# Altium schematic sheet LED_Shield_PCB_v11.SchDoc
size A4; SheetNumber: 1; SheetTotal: 1
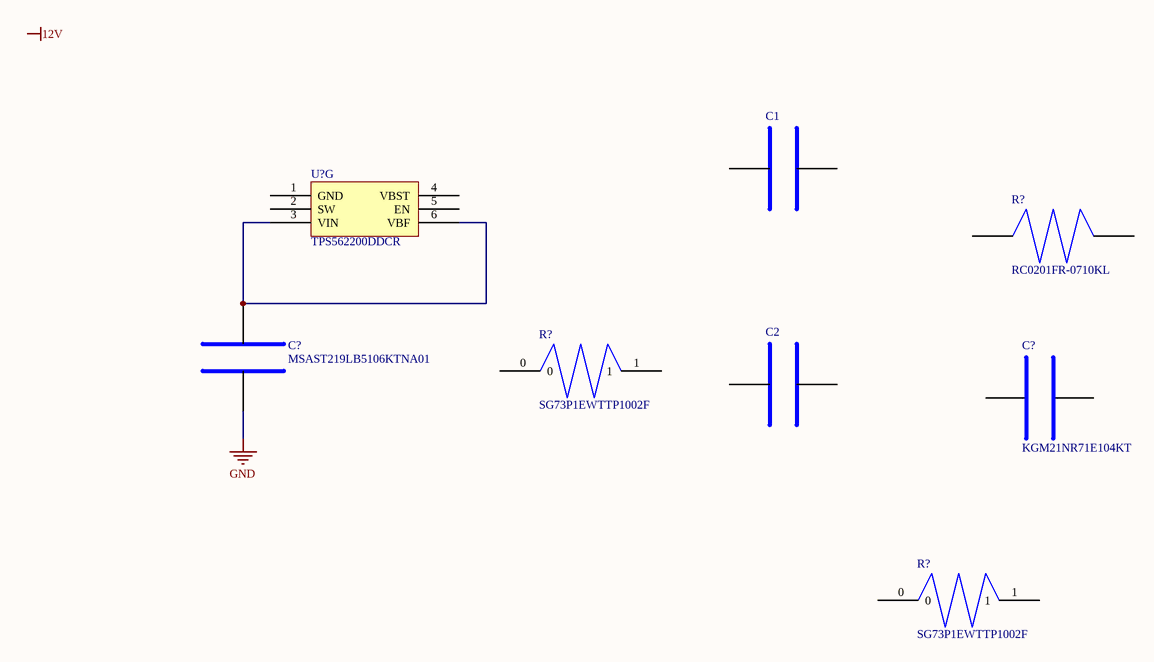
[diagram p0: LED_Shield_PCB_v11.SchDoc]

## Parts
(Parts that share a designator on the sheet are numbered #1, #2 ... from top to bottom, then left to right.)
C1  MSAST219LB5106KTNA01  [C_0805 (2012 Metric)]  (value not drawn)
C2  MSAST219LB5106KTNA01  [C_0805 (2012 Metric)]  (value not drawn)
C?#1  MSAST219LB5106KTNA01  [C_0805 (2012 Metric)]
C?#2  KGM21NR71E104KT  [C_0805 (2012 Metric)_2]
R?#1  RC0201FR-0710KL
R?#2  SG73P1EWTTP1002F  [R_0402 (1005 Metric)]
R?#3  SG73P1EWTTP1002F  [R_0402 (1005 Metric)]
U?  TPS562200DDCR  [U_SOT-23-6 Thin, TSOT-23-6]  (part G of 7)

## Nets
GND: C?#1.0
NetC?#1_1: C?#1.1 U?.3(VIN) U?.6(VBF)

Not connected (* = marked no-connect by the designer): C1 0 1; C2 0 1; C?#2 0 1; R?#1 0 1; R?#2 0 1; R?#3 0 1; U? 1(GND) 2(SW) 4(VBST) 5(EN)

## Notes on the sheet
- Labels drawn without touching a wire or pin: 12V

## Library data of the parts
C1 C2 C?#1 = MSAST219LB5106KTNA01: Ceramic Capacitor, Multilayer, Ceramic, 25V, 10% +Tol, 10% -Tol, X5R, 15% TC, 10uF, Surface Mount, 0805; Manufacturer: TAIYO YUDEN; Value: 10µF; Supplier: Arrow Electronics; Supplier Part Number: MSAST219LB5106KTNA01; Manufacturer Part Number: MSAST219LB5106KTNA01; RoHS: Compliant; Category: Ceramic Capacitors; Stock: 7; Pricing: 1=0,0066 (USD); Dielectric Material: Ceramic; Export Control Classification Number (ECCN) Code: EAR99; Height: 850µm; Harmonized Tariff Schedule (HTS) Code: 8532.24.00.20; Introduction Date: 2022-02-17; Length: 2mm; Lifecycle Status: Production; Max Operating Temperature: 85°C; Min Operating Temperature: -55°C; Mounting Technology: Surface Mount; Number of Terminals: 2; REACH SVHC: Yes; Voltage Rating (DC): 25V; Width: 1.25mm; ComponentLink1URL: https://datasheet.octopart.com:443/MSAST219LB5106KTNA01-Taiyo-Yuden-datasheet-182126366.pdf?src-supplier=IHS; ComponentLink1Description: https://datasheet.octopart.com:443/MSAST219LB5106KTNA01-Taiyo-Yuden-datasheet-182126366.pdf?src-supplier=IHS
R?#1 = RC0201FR-0710KL: Res Thick Film 0201 10K Ohm 1% 0.05W(1/20W) ±200ppm/C Pad SMD T/R; Manufacturer: Yageo Group; Max Power Dissipation: 50mW; Value: 10kΩ; Temperature Coefficient: 200ppm/°C; Voltage Rating: 25V; Supplier: Farnell; Supplier Part Number: 1857008; Manufacturer Part Number: RC0201FR-0710KL; RoHS: Compliant; Category: Chip SMD Resistors; Stock: 170907; Pricing: 10=0,0092, 100=0,0072, 500=0,0059, 2500=0,0046, 5000=0,0045 (EUR); Case/Package: 0201; Case Code (Imperial): 0201; Case Code (Metric): 0603; China RoHS: Non-Compliant; Composition: Thick Film; Contact Plating: Tin; Country of Origin: Mainland China, Taiwan; Depth: 300µm; Export Control Classification Number (ECCN) Code: EAR99; Features: Moisture Resistant; Height: 230µm; Harmonized Tariff Schedule (HTS) Code: 8533.21.00.30; Introduction Date: 2008-07-18; Lead Free: Lead Free; Length: 600µm; Lifecycle Status: Production; Max Operating Temperature: 125°C; Military Standard: Not; Min Operating Temperature: -55°C; Mounting Technology: Surface Mount; Pins: 2; Number of Terminals: 2; Number of Terminations: 2; Packaging: Tape & Reel; Power Dissipation: 50mW; Power Rating: 50mW; Radiation Hardening: No; REACH SVHC: Yes; Schedule B: 8533210045, 8533210045|8533210045|8533210045|8533210045|8533210045|8533210045|8533210045|8533210045|8533210045|8533210045|8533210045|8533210045|8533210045|8533210045|8533210045|8533210045|8533210045|8533210045|8533210045, 8533210045|8533210045|8533210045|8533210045|8533210045|8533210045|8533210045|8533210045|8533210045|8533210045|8533210045|8533210045|8533210045|8533210045|8533210045|8533210045|8533210045|8533210045|8533210045|8533210045, 8533210045|8533210045|8533210045|8533210045|8533210045|8533210045|8533210045|8533210045|8533210045|8533210045|8533210045|8533210045|8533210045|8533210045|8533210045|8533210045|8533210045|8533210045|8533210045|8533210045|8533210045; Termination: SMD/SMT; Tolerance: 1%; Voltage Rating (DC): 25V; Weight: 170.097139µg; Width: 300µm; Working Voltage: 25V; ComponentLink1URL: https://datasheet.octopart.com:443/RC0201FR-0710KL-Yageo-datasheet-175887523.pdf?src-supplier=IHS; ComponentLink1Description: https://datasheet.octopart.com:443/RC0201FR-0710KL-Yageo-datasheet-175887523.pdf?src-supplier=IHS; ComponentLink2URL: https://datasheet.octopart.com:443/RC0201FR-0710KL-Yageo-datasheet-12509713.pdf?src-supplier=element14+APAC; ComponentLink2Description: https://datasheet.octopart.com:443/RC0201FR-0710KL-Yageo-datasheet-12509713.pdf?src-supplier=element14+APAC; ComponentLink3URL: https://datasheet.octopart.com:443/RC0201FR-0710KL-Yageo-datasheet-62067350.pdf?src-supplier=element14+APAC; ComponentLink3Description: https://datasheet.octopart.com:443/RC0201FR-0710KL-Yageo-datasheet-62067350.pdf?src-supplier=element14+APAC; ComponentLink4URL: https://datasheet.octopart.com:443/RC0201FR-0710KL-Yageo-datasheet-10911895.pdf?src-supplier=element14+APAC; ComponentLink4Description: https://datasheet.octopart.com:443/RC0201FR-0710KL-Yageo-datasheet-10911895.pdf?src-supplier=element14+APAC; ComponentLink5URL: https://datasheet.octopart.com:443/RC0201FR-0710KL-Yageo-datasheet-13314888.pdf?src-supplier=Upverter; ComponentLink5Description: https://datasheet.octopart.com:443/RC0201FR-0710KL-Yageo-datasheet-13314888.pdf?src-supplier=Upverter; ComponentLink6URL: https://datasheet.octopart.com:443/RC0201FR-0710KL-Yageo-datasheet-12549147.pdf?src-supplier=Upverter; ComponentLink6Description: https://datasheet.octopart.com:443/RC0201FR-0710KL-Yageo-datasheet-12549147.pdf?src-supplier=Upverter; ComponentLink7URL: https://datasheet.octopart.com:443/RC0201FR-0710KL-Yageo-datasheet-12509741.pdf?src-supplier=Upverter; ComponentLink7Description: https://datasheet.octopart.com:443/RC0201FR-0710KL-Yageo-datasheet-12509741.pdf?src-supplier=Upverter; ComponentLink8URL: https://datasheet.octopart.com:443/RC0201FR-0710KL-Yageo-Group-datasheet-190305687.pdf?src-supplier=Newark; ComponentLink8Description: https://datasheet.octopart.com:443/RC0201FR-0710KL-Yageo-Group-datasheet-190305687.pdf?src-supplier=Newark; ComponentLink9URL: https://datasheet.octopart.com:443/RC0201FR-0710KL-Yageo-datasheet-10025917.pdf?src-supplier=Newark; ComponentLink9Description: https://datasheet.octopart.com:443/RC0201FR-0710KL-Yageo-datasheet-10025917.pdf?src-supplier=Newark; ComponentLink10URL: https://datasheet.octopart.com:443/RC0201FR-0710KL-Yageo-Group-datasheet-176638170.pdf?src-supplier=Future+Electronics; ComponentLink10Description: https://datasheet.octopart.com:443/RC0201FR-0710KL-Yageo-Group-datasheet-176638170.pdf?src-supplier=Future+Electronics; ComponentLink11URL: https://datasheet.octopart.com:443/RC0201FR-0710KL-Yageo-datasheet-164759695.pdf?src-supplier=Future+Electronics; ComponentLink11Description: https://datasheet.octopart.com:443/RC0201FR-0710KL-Yageo-datasheet-164759695.pdf?src-supplier=Future+Electronics; ComponentLink12URL: https://datasheet.octopart.com:443/RC0201FR-0710KL-Yageo-datasheet-127823281.pdf?src-supplier=Future+Electronics; ComponentLink12Description: https://datasheet.octopart.com:443/RC0201FR-0710KL-Yageo-datasheet-127823281.pdf?src-supplier=Future+Electronics; ComponentLink13URL: https://datasheet.octopart.com:443/RC0201FR-0710KL-Yageo-datasheet-137700087.pdf?src-supplier=Future+Electronics; ComponentLink13Description: https://datasheet.octopart.com:443/RC0201FR-0710KL-Yageo-datasheet-137700087.pdf?src-supplier=Future+Electronics; ComponentLink14URL: https://datasheet.octopart.com:443/RC0201FR-0710KL-Yageo-datasheet-103092701.pdf?src-supplier=Future+Electronics; ComponentLink14Description: https://datasheet.octopart.com:443/RC0201FR-0710KL-Yageo-datasheet-103092701.pdf?src-supplier=Future+Electronics; ComponentLink15URL: https://datasheet.octopart.com:443/RC0201FR-0710KL-Yageo-datasheet-98239111.pdf?src-supplier=Future+Electronics; ComponentLink15Description: https://datasheet.octopart.com:443/RC0201FR-0710KL-Yageo-datasheet-98239111.pdf?src-supplier=Future+Electronics; ComponentLink16URL: https://datasheet.octopart.com:443/RC0201FR-0710KL-Yageo-datasheet-44382975.pdf?src-supplier=Future+Electronics; ComponentLink16Description: https://datasheet.octopart.com:443/RC0201FR-0710KL-Yageo-datasheet-44382975.pdf?src-supplier=Future+Electronics; ComponentLink17URL: https://datasheet.octopart.com:443/RC0201FR-0710KL-Yageo-datasheet-41589693.pdf?src-supplier=Future+Electronics; ComponentLink17Description: https://datasheet.octopart.com:443/RC0201FR-0710KL-Yageo-datasheet-41589693.pdf?src-supplier=Future+Electronics; ComponentLink18URL: https://datasheet.octopart.com:443/RC0201FR-0710KL-Yageo-datasheet-37140709.pdf?src-supplier=Future+Electronics; ComponentLink18Description: https://datasheet.octopart.com:443/RC0201FR-0710KL-Yageo-datasheet-37140709.pdf?src-supplier=Future+Electronics; ComponentLink19URL: https://datasheet.octopart.com:443/RC0201FR-0710KL-Yageo-datasheet-12509768.pdf?src-supplier=Future+Electronics; ComponentLink19Description: https://datasheet.octopart.com:443/RC0201FR-0710KL-Yageo-datasheet-12509768.pdf?src-supplier=Future+Electronics; ComponentLink20URL: https://datasheet.octopart.com:443/RC0201FR-0710KL-Yageo-datasheet-12590898.pdf?src-supplier=Future+Electronics; ComponentLink20Description: https://datasheet.octopart.com:443/RC0201FR-0710KL-Yageo-datasheet-12590898.pdf?src-supplier=Future+Electronics; ComponentLink21URL: https://datasheet.octopart.com:443/RC0201FR-0710KL-Yageo-datasheet-5319114.pdf?src-supplier=Future+Electronics; ComponentLink21Description: https://datasheet.octopart.com:443/RC0201FR-0710KL-Yageo-datasheet-5319114.pdf?src-supplier=Future+Electronics; ComponentLink22URL: https://datasheet.octopart.com:443/RC0201FR-0710KL-Yageo-datasheet-12535854.pdf?src-supplier=Future+Electronics; ComponentLink22Description: https://datasheet.octopart.com:443/RC0201FR-0710KL-Yageo-datasheet-12535854.pdf?src-supplier=Future+Electronics; ComponentLink23URL: https://datasheet.octopart.com:443/RC0201FR-0710KL-Yageo-datasheet-148775077.pdf?src-supplier=TME; ComponentLink23Description: https://datasheet.octopart.com:443/RC0201FR-0710KL-Yageo-datasheet-148775077.pdf?src-supplier=TME; ComponentLink24URL: https://datasheet.octopart.com/RC0201FR-0710KL-Yageo-datasheet-73766026.pdf; ComponentLink24Description: https://datasheet.octopart.com/RC0201FR-0710KL-Yageo-datasheet-73766026.pdf; ComponentLink25URL: https://datasheet.octopart.com:443/RC0201FR-0710KL-Yageo-datasheet-8701561.pdf?src-supplier=element14; ComponentLink25Description: https://datasheet.octopart.com:443/RC0201FR-0710KL-Yageo-datasheet-8701561.pdf?src-supplier=element14; ComponentLink26URL: http://sigma.octopart.com:80/conflict_mineral_statement/Yageo-company-3.pdf?src-supplier=Compliance+Statements; ComponentLink26Description: http://sigma.octopart.com:80/conflict_mineral_statement/Yageo-company-3.pdf?src-supplier=Compliance+Statements; ComponentLink27URL: http://sigma.octopart.com:80/rohs_statement/Yageo-company-2.pdf?src-supplier=Compliance+Statements; ComponentLink27Description: http://sigma.octopart.com:80/rohs_statement/Yageo-company-2.pdf?src-supplier=Compliance+Statements
R?#2 R?#3 = SG73P1EWTTP1002F_1: Fixed Resistor, Metal Glaze/Thick Film, 0.25W, 10000ohm, 75V, 1% +/-Tol, Surface Mount, 0402; Manufacturer: KOA Speer; Power Dissipation: 250mW; Value: 10kΩ; Temperature Coefficient: 100ppm/°C; Supplier: Farnell; Supplier Part Number: 3931632; Manufacturer Part Number: SG73P1EWTTP1002F; RoHS: Compliant; Category: Chip SMD Resistors; Stock: 20460; Pricing: 10=0,0488, 100=0,0306, 500=0,0287, 2500=0,0268, 5000=0,022, 10000=0,0191 (EUR); Height: 350µm; Length: 1mm; Lifecycle Status: Production; Max Operating Temperature: 155°C; Min Operating Temperature: -55°C; Mounting Technology: Surface Mount; Number of Terminals: 2; REACH SVHC: Yes; Tolerance: 1%; Width: 500µm; Working Voltage: 75V; ComponentLink1URL: https://datasheet.octopart.com:443/SG73P1EWTTP1002F-KOA-Speer-datasheet-182143735.pdf?src-supplier=IHS; ComponentLink1Description: https://datasheet.octopart.com:443/SG73P1EWTTP1002F-KOA-Speer-datasheet-182143735.pdf?src-supplier=IHS; ComponentLink2URL: http://sigma.octopart.com:80/rohs_statement/KOA-Speer-company-17.pdf?src-supplier=Compliance+Statements; ComponentLink2Description: http://sigma.octopart.com:80/rohs_statement/KOA-Speer-company-17.pdf?src-supplier=Compliance+Statements
U? = TPS562200DDCR_1: Conv DC-DC 4.5V to 17V Step Down Single-Out 0.67V to 7V 2A 6-Pin TSOT-23 T/R; Manufacturer: Texas Instruments; Manufacturer Lifecycle Status: ACTIVE; Max Duty Cycle: 65%; Max Junction Temperature (Tj): 150°C; Min Output Voltage: 765mV; Nominal Supply Current: 230µA; Number of Channels: 1; Output Configuration: Positive; Output Type: Adjustable; Output Voltage: 1.05V; Switching Frequency: 650kHz; Synchronous Rectifier: Yes; Topology: Buck; Supplier: Arrow Electronics; Supplier Part Number: TPS562200DDCR; Manufacturer Part Number: TPS562200DDCR; RoHS: Compliant; Category: Voltage Regulators - Switching; Stock: 33000; Pricing: 3000=0,3243, 6000=0,3137, 9000=0,3113 (USD); Ambient Temperature Range High: 85°C; Case/Package: SOT-23-6; Contact Plating: Tin; Height: 1.1mm; Lead Free: Lead Free; Length: 2.9mm; Lifecycle Status: Production; Max Supply Voltage: 17V; Max Operating Temperature: 125°C; Max Output current: 2A; Max Output Voltage: 7V; Min Input Voltage: 4.5V; Min Operating Temperature: -40°C; Min Supply Voltage: 4.5V; Mounting Technology: Surface Mount; Number of Outputs: 1; Pins: 6; Operating Supply Voltage: 17V; Output Current: 2A; Quiescent Current: 230µA; Radiation Hardening: No; REACH SVHC: No; Schedule B: 8542390000; Thickness: 870µm; Weight: 36.003894mg; Width: 1.6mm; ComponentLink1URL: https://sigma.octopart.com:443/180581133/technical_drawing/Texas-Instruments-TPS562200DDCR.pdf?src-supplier=Texas+Instruments; ComponentLink1Description: https://sigma.octopart.com:443/180581133/technical_drawing/Texas-Instruments-TPS562200DDCR.pdf?src-supplier=Texas+Instruments; ComponentLink2URL: https://octopart.com:443/opatz8j6/c1?t=2utKubAfpiZARX5nFmsE5hGk-Y-tapj6pD_xDeMavGILmoCS9J2eAjjTjNW5Z9c81h6alCPz7bJak1jHKeuWNAeaEIwGhAOxkrndFGX56Qt-YTBzMSW5WpBFdiamkSgyJwOWbAqhxLCfwYLVTxlMZ3D8olLGDhK9RqQ3qjVP-W0npcJpvlqS_C2JNbfqAdkRII-uSWYYqmMgwYeGA5yIbbvEjU5phFCuYsjJv_b7aQSoOIgzwGiDRTTWzzO_HqVSYJIJZJ4c3RZs3GIMQ7XGM0Tmug74GIe09f5U_717lcCnX6GkmB4tYX5l7RHdDg8UKRkvjrB66qfKxFpTpb8aDJ9_oKYvujJkg67F35zetmHwPDR4DgWTV3Fi_ByFnpJz6qQT-ugHig&src-supplier=Texas+Instruments; ComponentLink2Description: https://octopart.com:443/opatz8j6/c1?t=2utKubAfpiZARX5nFmsE5hGk-Y-tapj6pD_xDeMavGILmoCS9J2eAjjTjNW5Z9c81h6alCPz7bJak1jHKeuWNAeaEIwGhAOxkrndFGX56Qt-YTBzMSW5WpBFdiamkSgyJwOWbAqhxLCfwYLVTxlMZ3D8olLGDhK9RqQ3qjVP-W0npcJpvlqS_C2JNbfqAdkRII-uSWYYqmMgwYeGA5yIbbvEjU5phFCuYsjJv_b7aQSoOIgzwGiDRTTWzzO_HqVSYJIJZJ4c3RZs3GIMQ7XGM0Tmug74GIe09f5U_717lcCnX6GkmB4tYX5l7RHdDg8UKRkvjrB66qfKxFpTpb8aDJ9_oKYvujJkg67F35zetmHwPDR4DgWTV3Fi_ByFnpJz6qQT-ugHig&src-supplier=Texas+Instruments; ComponentLink3URL: https://sigma.octopart.com:443/179311906/technical_drawing/Texas-Instruments-TPS562200DDCR.pdf?src-supplier=Texas+Instruments; ComponentLink3Description: https://sigma.octopart.com:443/179311906/technical_drawing/Texas-Instruments-TPS562200DDCR.pdf?src-supplier=Texas+Instruments; ComponentLink4URL: https://sigma.octopart.com:443/159779760/technical_drawing/Texas-Instruments-TPS562200DDCR.pdf?src-supplier=Texas+Instruments; ComponentLink4Description: https://sigma.octopart.com:443/159779760/technical_drawing/Texas-Instruments-TPS562200DDCR.pdf?src-supplier=Texas+Instruments; ComponentLink5URL: https://sigma.octopart.com:443/149167535/technical_drawing/Texas-Instruments-TPS562200DDCR.pdf?src-supplier=Texas+Instruments; ComponentLink5Description: https://sigma.octopart.com:443/149167535/technical_drawing/Texas-Instruments-TPS562200DDCR.pdf?src-supplier=Texas+Instruments; ComponentLink6URL: https://datasheet.octopart.com:443/TPS562200DDCR-Texas-Instruments-datasheet-37741624.pdf?src-supplier=Texas+Instruments; ComponentLink6Description: https://datasheet.octopart.com:443/TPS562200DDCR-Texas-Instruments-datasheet-37741624.pdf?src-supplier=Texas+Instruments; ComponentLink7URL: https://datasheet.octopart.com:443/TPS562200DDCR-Texas-Instruments-datasheet-32015787.pdf?src-supplier=Texas+Instruments; ComponentLink7Description: https://datasheet.octopart.com:443/TPS562200DDCR-Texas-Instruments-datasheet-32015787.pdf?src-supplier=Texas+Instruments; ComponentLink8URL: https://datasheet.octopart.com:443/TPS562200DDCR-Texas-Instruments-datasheet-22069471.pdf?src-supplier=Texas+Instruments; ComponentLink8Description: https://datasheet.octopart.com:443/TPS562200DDCR-Texas-Instruments-datasheet-22069471.pdf?src-supplier=Texas+Instruments; ComponentLink9URL: https://sigma.octopart.com:443/49250152/technical_drawing/Texas-Instruments-TPS562200DDCR.pdf?src-supplier=Texas+Instruments; ComponentLink9Description: https://sigma.octopart.com:443/49250152/technical_drawing/Texas-Instruments-TPS562200DDCR.pdf?src-supplier=Texas+Instruments; ComponentLink10URL: https://datasheet.octopart.com:443/TPS562200DDCR-Texas-Instruments-datasheet-66617798.pdf?src-supplier=element14+APAC; ComponentLink10Description: https://datasheet.octopart.com:443/TPS562200DDCR-Texas-Instruments-datasheet-66617798.pdf?src-supplier=element14+APAC; ComponentLink11URL: https://datasheet.octopart.com:443/TPS562200DDCR-Texas-Instruments-datasheet-62313215.pdf?src-supplier=Newark; ComponentLink11Description: https://datasheet.octopart.com:443/TPS562200DDCR-Texas-Instruments-datasheet-62313215.pdf?src-supplier=Newark; ComponentLink12URL: https://datasheet.octopart.com:443/TPS562200DDCR-Texas-Instruments-datasheet-62292600.pdf?src-supplier=Farnell; ComponentLink12Description: https://datasheet.octopart.com:443/TPS562200DDCR-Texas-Instruments-datasheet-62292600.pdf?src-supplier=Farnell; ComponentLink13URL: https://datasheet.octopart.com:443/TPS562200DDCR-Texas-Instruments-datasheet-165804781.pdf?src-supplier=LCSC; ComponentLink13Description: https://datasheet.octopart.com:443/TPS562200DDCR-Texas-Instruments-datasheet-165804781.pdf?src-supplier=LCSC; ComponentLink14URL: https://datasheet.octopart.com:443/TPS562200DDCR-Texas-Instruments-datasheet-159118148.pdf?src-supplier=LCSC; ComponentLink14Description: https://datasheet.octopart.com:443/TPS562200DDCR-Texas-Instruments-datasheet-159118148.pdf?src-supplier=LCSC; ComponentLink15URL: https://datasheet.octopart.com:443/TPS562200DDCR-Texas-Instruments-datasheet-137316104.pdf?src-supplier=Future+Electronics; ComponentLink15Description: https://datasheet.octopart.com:443/TPS562200DDCR-Texas-Instruments-datasheet-137316104.pdf?src-supplier=Future+Electronics; ComponentLink16URL: http://sigma.octopart.com:80/reach_statement/Texas-Instruments-company-64.pdf?src-supplier=Compliance+Statements; ComponentLink16Description: http://sigma.octopart.com:80/reach_statement/Texas-Instruments-company-64.pdf?src-supplier=Compliance+Statements; ComponentLink17URL: http://sigma.octopart.com:80/conflict_mineral_statement/Texas-Instruments-company-63.pdf?src-supplier=Compliance+Statements; ComponentLink17Description: http://sigma.octopart.com:80/conflict_mineral_statement/Texas-Instruments-company-63.pdf?src-supplier=Compliance+Statements